# Altium schematic sheet net_w5500.SchDoc
size A4
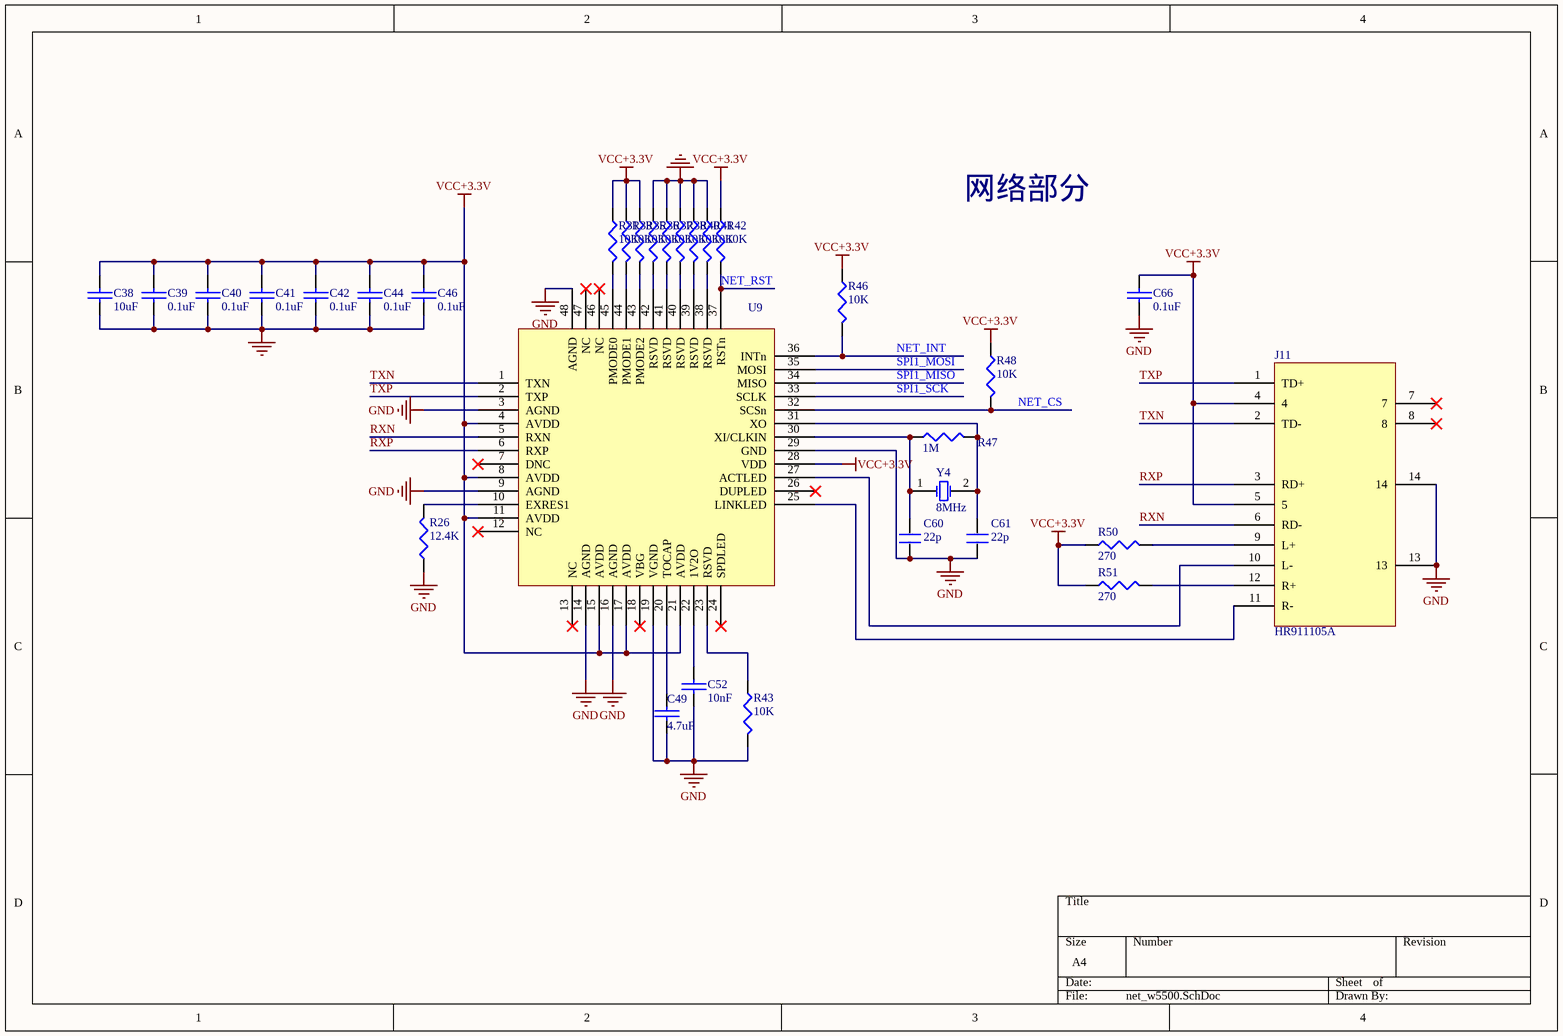
[diagram p0: net_w5500.SchDoc]

## Parts
C38  10uF  [0805]
C39  0.1uF  [0603]
C40  0.1uF  [0603]
C41  0.1uF  [0603]
C42  0.1uF  [0603]
C44  0.1uF  [0603]
C46  0.1uF  [0603]
C49  4.7uF  [0805]
C52  10nF  [0603]
C60  22p  [0603]
C61  22p  [0603]
C66  0.1uF  [0603]
J11  HR911105A  [HR911105A]
R26  12.4K  [0603]
R31  10K  [0603]
R33  10K  [0603]
R35  10K  [0603]
R36  10K  [0603]
R37  10K  [0603]
R38  10K  [0603]
R40  10K  [0603]
R41  10K  [0603]
R42  10K  [0603]
R43  10K  [0603]
R46  10K  [0603]
R47  1M  [0603]
R48  10K  [0603]
R50  270  [0603]
R51  270  [0603]
U9  W5500  [LQFP48_N]  (value not drawn)
Y4  8MHz  [XTAL_US]

## Nets
GND: C38.1 C39.2 C40.2 C41.2 C42.2 C44.2 C46.2 C49.1 C52.2 C60.1 C61.1 C66.2 J11.13 J11.14 R26.1 R36.1 R37.1 R38.1 R40.1 R41.1 R43.2 U9.3(AGND) U9.9(AGND) U9.14(AGND) U9.16(AGND) U9.19(VGND) U9.29(GND) U9.48(AGND)
VCC+3.3V: C38.2 C39.1 C40.1 C41.1 C42.1 C44.1 C46.1 C66.1 J11.4 J11.5 R31.1 R33.1 R35.1 R42.1 R46.1 R48.1 R50.1 R51.1 U9.4(AVDD) U9.8(AVDD) U9.11(AVDD) U9.15(AVDD) U9.17(AVDD) U9.21(AVDD) U9.28(VDD)
NET_CS: R48.2 U9.32(SCSn)
NET_INT: R46.2 U9.36(INTn)
NET_RST: R42.2 U9.37(RSTn)
RXN: J11.6(RD-) U9.5(RXN)
RXP: J11.3(RD+) U9.6(RXP)
SPI1_MISO: U9.34(MISO)
SPI1_MOSI: U9.35(MOSI)
SPI1_SCK: U9.33(SCLK)
TXN: J11.2(TD-) U9.1(TXN)
TXP: J11.1(TD+) U9.2(TXP)
NetC49_2: C49.2 U9.20(TOCAP)
NetC52_1: C52.1 U9.22(1V2O)
NetC60_2: C60.2 R47.1 U9.30(XI/CLKIN) Y4.1(OSC1)
NetC61_2: C61.2 R47.2 U9.31(XO) Y4.2(OSC2)
NetJ11_9: J11.9(L+) R50.2
NetJ11_10: J11.10(L-) U9.27(ACTLED)
NetJ11_11: J11.11(R-) U9.25(LINKLED)
NetJ11_12: J11.12(R+) R51.2
NetR26_2: R26.2 U9.10(EXRES1)
NetR31_2: R31.2 U9.45(PMODE0)
NetR33_2: R33.2 U9.44(PMODE1)
NetR35_2: R35.2 U9.43(PMODE2)
NetR36_2: R36.2 U9.42(RSVD)
NetR37_2: R37.2 U9.41(RSVD)
NetR38_2: R38.2 U9.40(RSVD)
NetR40_2: R40.2 U9.39(RSVD)
NetR41_2: R41.2 U9.38(RSVD)
NetR43_1: R43.1 U9.23(RSVD)

Not connected (* = marked no-connect by the designer): J11 7* 8*; U9 7(DNC)* 12(NC)* 13(NC)* 18(VBG)* 24(SPDLED)* 26(DUPLED)* 46(NC)* 47(NC)*

## Notes on the sheet
- 网络部分

## Library data of the parts
C38 C49 = CAP: 0.1uF
C39-C42 C44 C46 C52 C66 = CAP
C60 C61 = C
R26 R31 R33 R35-R38 R40-R43 R46-R48 R50 R51 = RES1
U9 = W5500: 以太网
Y4 = XTAL: Crystal Oscillator; Published: 8-Jun-2000; LatestRevisionDate: 17-Jul-2002; LatestRevisionNote: Re-released for DXP Platform.; Publisher: Altium Limited